# Altium project modulo_LCD_ShiftRegister.PrjPcb
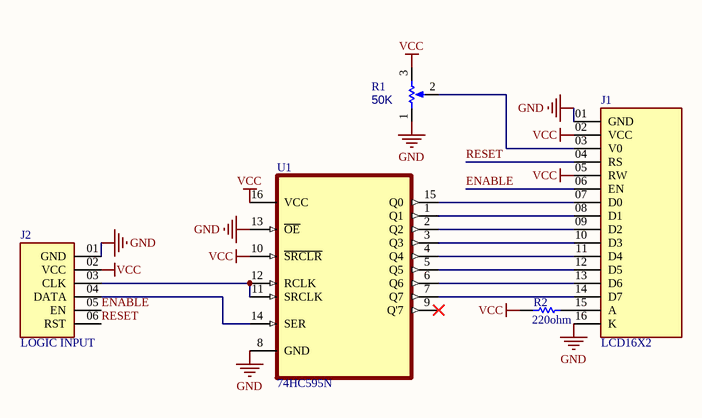
[diagram p0: modulo_LCD_ShiftRegister_SCH.SchDoc]
1 sheet, 5 parts. Net scope: global (net labels, ports and power ports of the same name join across sheets).
Board file: modulo_LCD_ShiftRegister_PCB.PcbDoc

## Sheet modulo_LCD_ShiftRegister_SCH.SchDoc
size A4; SheetNumber: 1; SheetTotal: 1

### Parts
J1  LCD16X2  [HEADER 16 PIN]
J2  LOGIC INPUT  [HEADER 6 PIN]
R1  50K  [TRIMMING POTENTIOMETER]
R2  220ohm  [Res Axial 0.5]
U1  74HC595N  [DIP254P762X420-16]

### Nets
GND: J1.01(GND) J1.16(K) J2.01(GND) R1.1(TOP) U1.8(GND) U1.13(~{OE})
VCC: J1.02(VCC) J1.05(RW) J2.02(VCC) R1.3(BOT) R2.1 U1.10(~{SRCLR}) U1.16(VCC)
ENABLE: J1.06(EN) J2.05(EN)
RESET: J1.04(RS) J2.06(RST)
NetJ1_03: J1.03(V0) R1.2(TAP)
NetJ1_07: J1.07(D0) U1.15(Q0)
NetJ1_08: J1.08(D1) U1.1(Q1)
NetJ1_09: J1.09(D2) U1.2(Q2)
NetJ1_10: J1.10(D3) U1.3(Q3)
NetJ1_11: J1.11(D4) U1.4(Q4)
NetJ1_12: J1.12(D5) U1.5(Q5)
NetJ1_13: J1.13(D6) U1.6(Q6)
NetJ1_14: J1.14(D7) U1.7(Q7)
NetJ1_15: J1.15(A) R2.2
NetJ2_03: J2.03(CLK) U1.11(SRCLK) U1.12(RCLK)
NetJ2_04: J2.04(DATA) U1.14(SER)

Not connected (* = marked no-connect by the designer): U1 9(Q'7)*

### Library data of the parts
J1 = LCD16X2: MP: TSW-116-07-T-S-LL; Availability: Unavailable; Package: None; Price: None; Value: *
J2 = LOGIC INPUT: Connector Header Through Hole 6 position 0.100 (2.54mm); MF: Samtec; MP: TSW-106-26-T-S; SnapEDA_Link: https://www.snapeda.com/parts/TSW-106-26-T-S/Samtec/view-part/?ref=snap; Package: None; Value: *; Check_prices: https://www.snapeda.com/parts/TSW-106-26-T-S/Samtec/view-part/?ref=eda
R1 = Potentiometer: 4K7; value: 1k; position: 0.5; SimulationGenericComponent: True
R2 = Res1: Resistor; Published: 8-Jun-2000; LatestRevisionDate: 17-Jul-2002; LatestRevisionNote: Re-released for DXP Platform.; PackageReference: AXIAL-0.3; Publisher: Altium Limited; PackageDescription: Axial Device, Thru-Hole; 2 Leads; 0.3 in Pin Spacing
U1 = 74HC595N,112: Shift Shift Register 1 Element 8 Bit 16-DIP; MF: NXP USA; Purchase-URL: https://pricing.snapeda.com/search/part/74HC595N,112/?ref=eda; Package: SOT38-4-16 Nexperia; Value: *; Check_prices: https://www.snapeda.com/parts/74HC595N,112/NXP+USA+Inc./view-part/?ref=eda; SnapEDA_Link: https://www.snapeda.com/parts/74HC595N,112/NXP+USA+Inc./view-part/?ref=snap; Availability: In Stock; Price: None; MP: 74HC595N,112